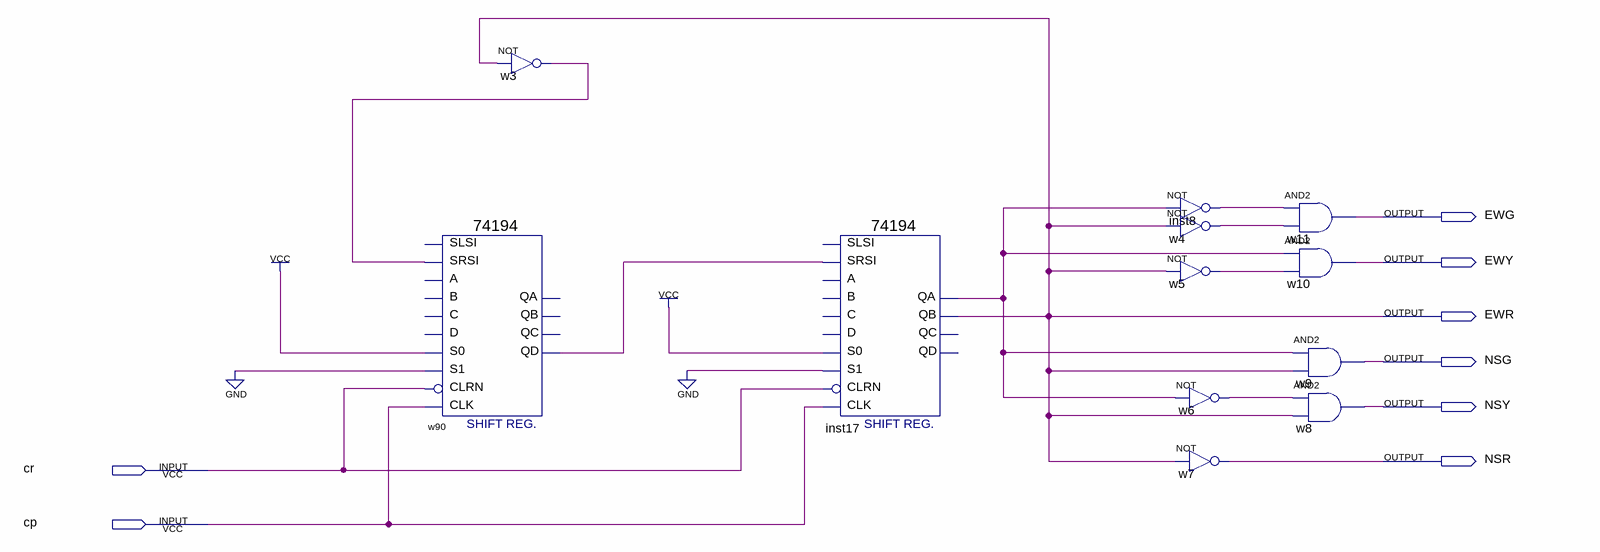
[diagram p0: schematic sheet]
// Quartus schematic mo12.bdf as structural Verilog: 12 symbols, 8 pins
module mo12 (
  input  cr,
  input  cp,
  output EWG,
  output EWY,
  output EWR,
  output NSG,
  output NSY,
  output NSR
);

  wire inst8_out, inst17_qa, w3_out, w4_out, w5_out, w6_out, w90_qd;

  \74194  w90 (
    .SRSI(w3_out), .CLK(cp), .CLRN(cr), .S1(1'b0), .S0(1'b1), .QD(w90_qd));  // open: SLSI, B, C, D, A, QA, QB, QC
  not w3 (w3_out, EWR);
  \74194  inst17 (
    .SRSI(w90_qd), .CLK(cp), .CLRN(cr), .S1(1'b0), .S0(1'b1), .QA(inst17_qa), .QB(EWR));  // open: SLSI, B, C, D, A, QC, QD
  not inst8 (inst8_out, inst17_qa);
  not w4 (w4_out, EWR);
  not w5 (w5_out, EWR);
  not w6 (w6_out, inst17_qa);
  not w7 (NSR, EWR);
  and w11 (EWG, inst8_out, w4_out);
  and w10 (EWY, inst17_qa, w5_out);
  and w9 (NSG, inst17_qa, EWR);
  and w8 (NSY, w6_out, EWR);
endmodule
